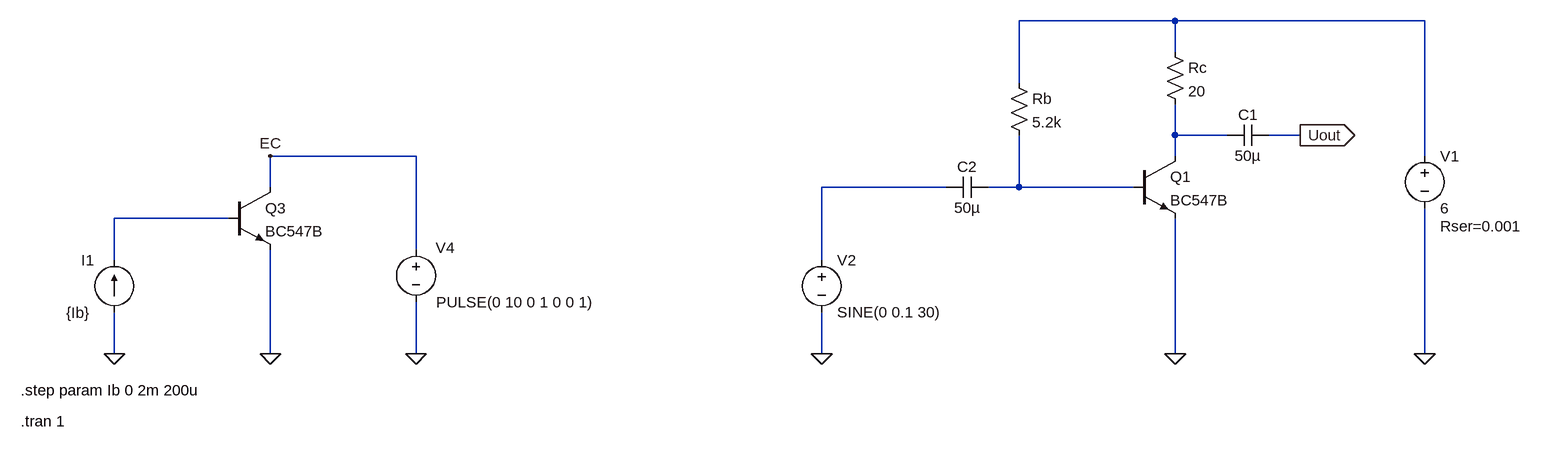
[diagram p0: schematic npn-characteristics.asc]
npn-characteristics.asc, the LTspice schematic file:
Version 4
SHEET 1 932 680
WIRE 208 -80 -32 -80
WIRE 592 -80 208 -80
WIRE 208 -32 208 -80
WIRE -32 16 -32 -80
WIRE 208 96 208 48
WIRE 288 96 208 96
WIRE 400 96 352 96
WIRE -960 128 -1184 128
WIRE 208 128 208 96
WIRE 592 128 592 -80
WIRE -1184 176 -1184 128
WIRE -144 176 -336 176
WIRE -32 176 -32 96
WIRE -32 176 -80 176
WIRE 144 176 -32 176
WIRE -1248 224 -1424 224
WIRE -960 272 -960 128
WIRE -1424 288 -1424 224
WIRE -336 288 -336 176
WIRE -1424 432 -1424 368
WIRE -1184 432 -1184 272
WIRE -960 432 -960 352
WIRE -336 432 -336 368
WIRE 208 432 208 224
WIRE 592 432 592 208
FLAG 592 432 0
FLAG 208 432 0
FLAG -336 432 0
FLAG 400 96 Uout
IOPIN 400 96 Out
FLAG -960 432 0
FLAG -1424 432 0
FLAG -1184 432 0
FLAG -1184 128 EC
SYMBOL res 192 -48 R0
SYMATTR InstName Rc
SYMATTR Value 20
SYMBOL res -48 0 R0
SYMATTR InstName Rb
SYMATTR Value 5.2k
SYMBOL voltage 592 112 R0
WINDOW 123 0 0 Left 0
WINDOW 39 24 124 Left 2
SYMATTR SpiceLine Rser=0.001
SYMATTR InstName V1
SYMATTR Value 6
SYMBOL cap 352 80 R90
WINDOW 0 0 32 VBottom 2
WINDOW 3 32 32 VTop 2
SYMATTR InstName C1
SYMATTR Value 50µ
SYMBOL voltage -336 272 R0
WINDOW 123 0 0 Left 0
WINDOW 39 0 0 Left 0
SYMATTR InstName V2
SYMATTR Value SINE(0 0.1 30)
SYMBOL voltage -960 256 R0
WINDOW 0 30 13 Left 2
WINDOW 3 31 97 Left 2
WINDOW 123 0 0 Left 0
WINDOW 39 0 0 Left 0
SYMATTR InstName V4
SYMATTR Value PULSE(0 10 0 1 0 0 1)
SYMBOL current -1424 368 R180
WINDOW 123 0 0 Left 0
WINDOW 39 0 0 Left 0
WINDOW 0 31 80 Left 2
WINDOW 3 37 -1 Left 2
SYMATTR InstName I1
SYMATTR Value {Ib}
SYMBOL npn -1248 176 R0
SYMATTR InstName Q3
SYMATTR Value BC547B
SYMBOL npn 144 128 R0
SYMATTR InstName Q1
SYMATTR Value BC547B
SYMBOL cap -80 160 R90
WINDOW 0 0 32 VBottom 2
WINDOW 3 32 32 VTop 2
SYMATTR InstName C2
SYMATTR Value 50µ
TEXT -1568 488 Left 2 !.step param Ib 0 2m 200u
TEXT -1568 536 Left 2 !.tran 1

The netlist it stands for:
* npn-characteristics.asc
Rc N001 N002 20
Rb N001 N004 5.2k
V1 N001 0 6 Rser=0.001
C1 Uout N002 50µ
V2 N003 0 SINE(0 0.1 30)
V4 EC 0 PULSE(0 10 0 1 0 0 1)
I1 0 N005 {Ib}
Q3 EC N005 0 0 BC547B
Q1 N002 N004 0 0 BC547B
C2 N004 N003 50µ
.model NPN NPN
.model PNP PNP
.lib standard.bjt
.step param Ib 0 2m 200u
.tran 1
.backanno
.end